# Altium schematic sheet KickerManager.SchDoc: Gestion du kicker
size A4; DocumentNumber: 1; Revision: Simon Bouchard; SheetNumber: 1; SheetTotal: 4; Version: Gamma 1.0; Conceptor: Philippe T. Simon B. Léonard G. Alexia B-L.
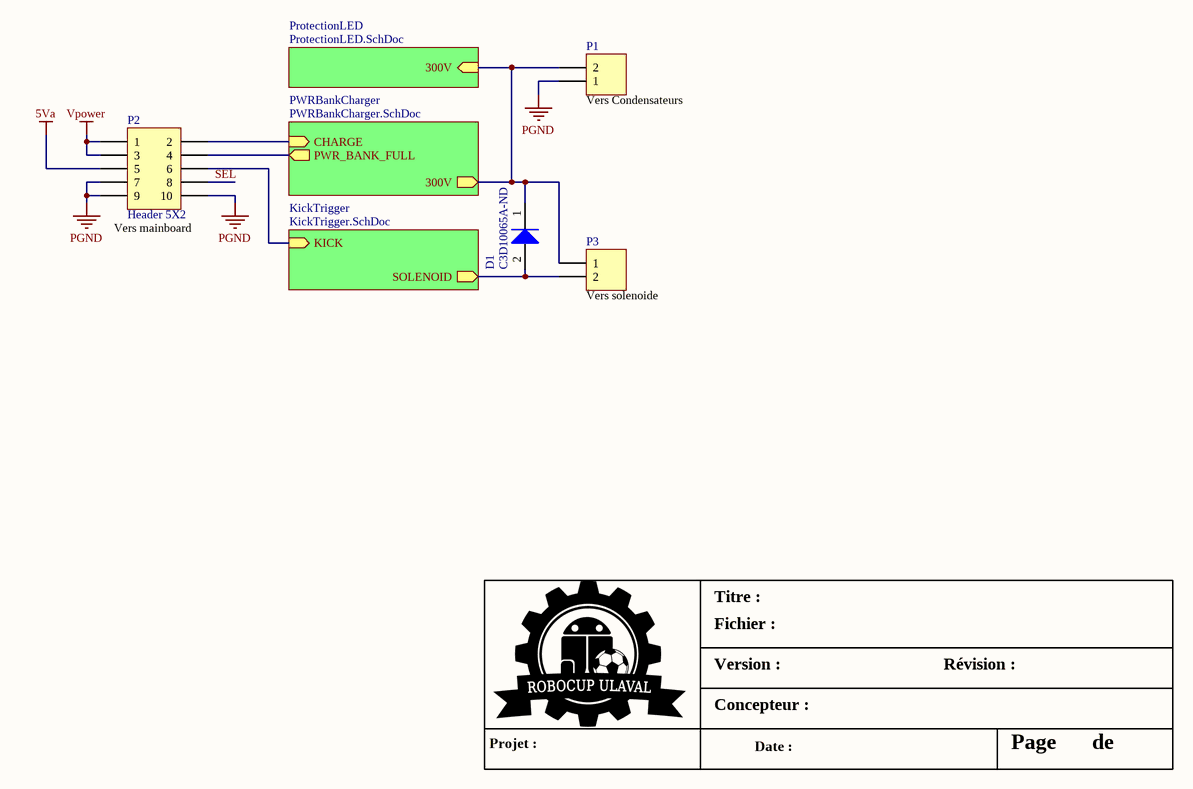
[diagram p0: KickerManager.SchDoc]

## Parts
D1  Supplier Part Number 1: C3D10065A-ND  [TO-220-2]  (hidden comment: Diode 1N4007)
P1  Header 2  [0.156mil header]  (value not drawn)
P2  Header 5X2  [HDR2X5]
P3  Header 2  [0.156mil header]  (value not drawn)

## Sub-sheets
KickTrigger = KickTrigger.SchDoc: KICK (in), SOLENOID (out)
ProtectionLED = ProtectionLED.SchDoc: 300V (in)
PWRBankCharger = PWRBankCharger.SchDoc: CHARGE (in), PWR_BANK_FULL (out), 300V (out)

## Nets
5Va: P2.5
PGND: P1.1 P2.7 P2.9 P2.10
Vpower: P2.1 P2.3
SEL: P2.8
NetD1_1: D1.1(K) P1.2 P3.1 ; sheet PWRBankCharger/300V, sheet ProtectionLED/300V
NetD1_2: D1.2(A) P3.2 ; sheet KickTrigger/SOLENOID
NetP2_2: P2.2 ; sheet PWRBankCharger/CHARGE
NetP2_4: P2.4 ; sheet PWRBankCharger/PWR_BANK_FULL
NetP2_6: P2.6 ; sheet KickTrigger/KICK

## Notes on the sheet
- (near P1) Vers Condensateurs
- (near P2) Vers mainboard
- (near P3) Vers solenoide
- Titre :
- Version :
- Fichier :
- Révision :
- Projet :
- Concepteur :
- Date :
- Page
- de

## Library data of the parts
D1 = Diode 1N4007: DIODE SCHOTTKY 650V 10A TO220-2; Manufacturer: Cree/Wolfspeed; Manufacturer Part Number: C3D10065A; Diode Type: Silicon Carbide Schottky; Current - Average Rectified (Io): 10A (DC); Voltage - Forward (Vf) (Max) @ If: 1.8V @ 10A; Speed: No Recovery Time > 500mA (Io); Reverse Recovery Time (trr): 0ns; Current - Reverse Leakage @ Vr: 60µA @ 650V; Capacitance @ Vr, F: 480pF @ 0V, 1MHz; Supplier 1: Digi-Key; RoHS: RoHS Compliant; Category: Discrete Semiconductor Products; Stock 1: 1057; Pricing 1: 1=7.29, 100=6.0738, 500=5.2122, 1000=4.56245 (CAD); Packaging: Tube; Part Status: Active; Voltage - DC Reverse (Vr) (Max): 650V; Mounting Type: Through Hole; Package / Case: TO-220-2; Supplier Device Package: TO-220-2; Operating Temperature - Junction: -55°C ~ 175°C; ComponentLink1URL: http://www.wolfspeed.com/media/downloads/73/C3D10065A.pdf; ComponentLink1Description: http://www.wolfspeed.com/media/downloads/73/C3D10065A.pdf
P1 P3 = Header 2pin 0.156: Header, 2-Pin, 0.156mil
P2 = Header 5X2: Header, 5-Pin, Dual row; LatestRevisionDate: 17-Jul-2002; LatestRevisionNote: Re-released for DXP Platform.; Publisher: Altium Limited